# Altium schematic sheet LedAlert.SchDoc
size A
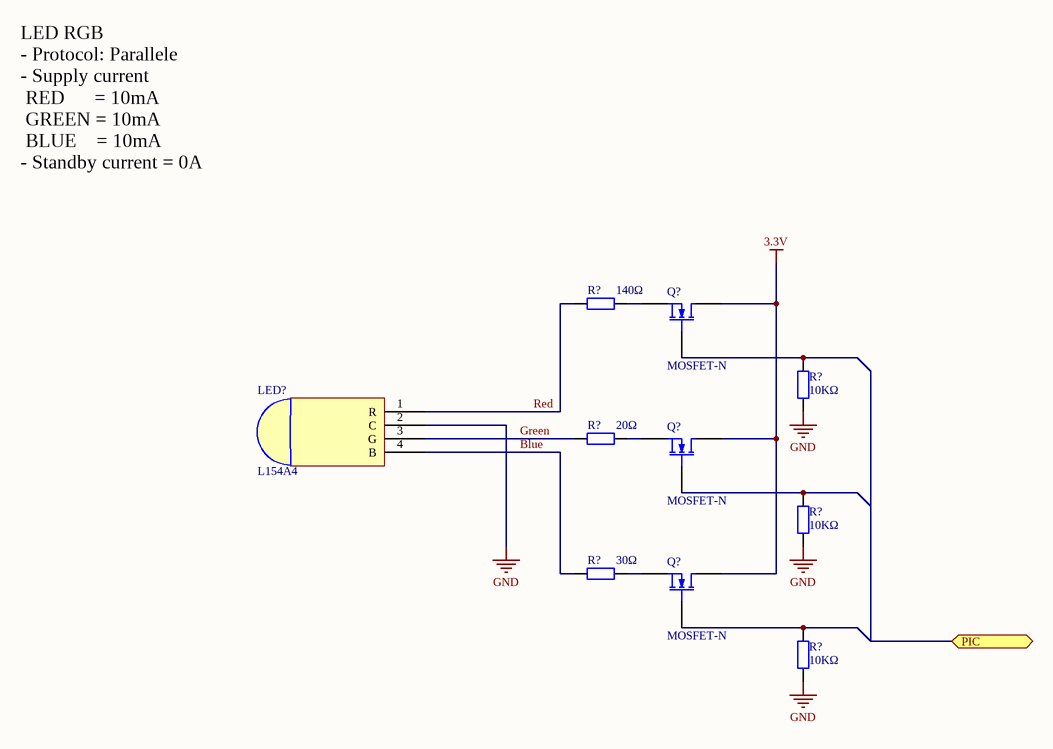
[diagram p0: LedAlert.SchDoc]

## Parts
(Parts that share a designator on the sheet are numbered #1, #2 ... from top to bottom, then left to right.)
LED?  L154A4
Q?#1  MOSFET-N  [E3]
Q?#2  MOSFET-N  [E3]
Q?#3  MOSFET-N  [E3]
R?#1  140Ω  [AXIAL-0.4]
R?#2  10KΩ  [AXIAL-0.4]
R?#3  20Ω  [AXIAL-0.4]
R?#4  10KΩ  [AXIAL-0.4]
R?#5  30Ω  [AXIAL-0.4]
R?#6  10KΩ  [AXIAL-0.4]

## Ports
PIC

## Nets
3.3V: Q?#1.1(D) Q?#2.1(D) Q?#3.1(D)
GND: LED?.2(C) R?#2.2 R?#4.2 R?#6.2
Blue: LED?.4(B) R?#5.2
Green: LED?.3(G) R?#3.2
Red: LED?.1(R) R?#1.2
NetQ?#1_2: Q?#1.2(G) R?#2.1
NetQ?#1_3: Q?#1.3(S) R?#1.1
NetQ?#2_2: Q?#2.2(G) R?#4.1
NetQ?#2_3: Q?#2.3(S) R?#3.1
NetQ?#3_2: Q?#3.2(G) R?#6.1
NetQ?#3_3: Q?#3.3(S) R?#5.1

## Notes on the sheet
- LED RGB
  - Protocol: Parallele
  - Supply current
  RED      = 10mA
  GREEN = 10mA
  BLUE    = 10mA
  - Standby current = 0A

## Library data of the parts
LED? = Component_1
Q?#1-Q?#3 = MOSFET-N: N-Channel MOSFET; Published: 8-Jun-2000; LatestRevisionDate: 17-Jul-2002; LatestRevisionNote: Re-released for DXP Platform.; PackageVersion: 1995/1996; PackageReference: E3; Publisher: Altium Limited; PackageDescription: TO, Flat Index; 3 In-Line, Axial Leads; Body Dia. 4.6mm; Lead Dia. 0.5 mm (max)
R?#1-R?#6 = Res2: Resistor; Value: 1K; Published: 8-Jun-2000; LatestRevisionDate: 17-Jul-2002; LatestRevisionNote: Re-released for DXP Platform.; PackageReference: AXIAL-0.4; Publisher: Altium Limited; PackageDescription: Axial Device, Thru-Hole; 2 Leads; 0.4 in Pin Spacing